# Altium schematic sheet DSPCONN.12-15.SCHDOC: Backplane
size B; Engineer: Eric Jonas; Organization: Wilson Lab; Address1: Picower Institute, MIT; Address2: 43 Vassar St. 46-5227; Address3: Cambridge, MA 02139; Address4: Australia 2086
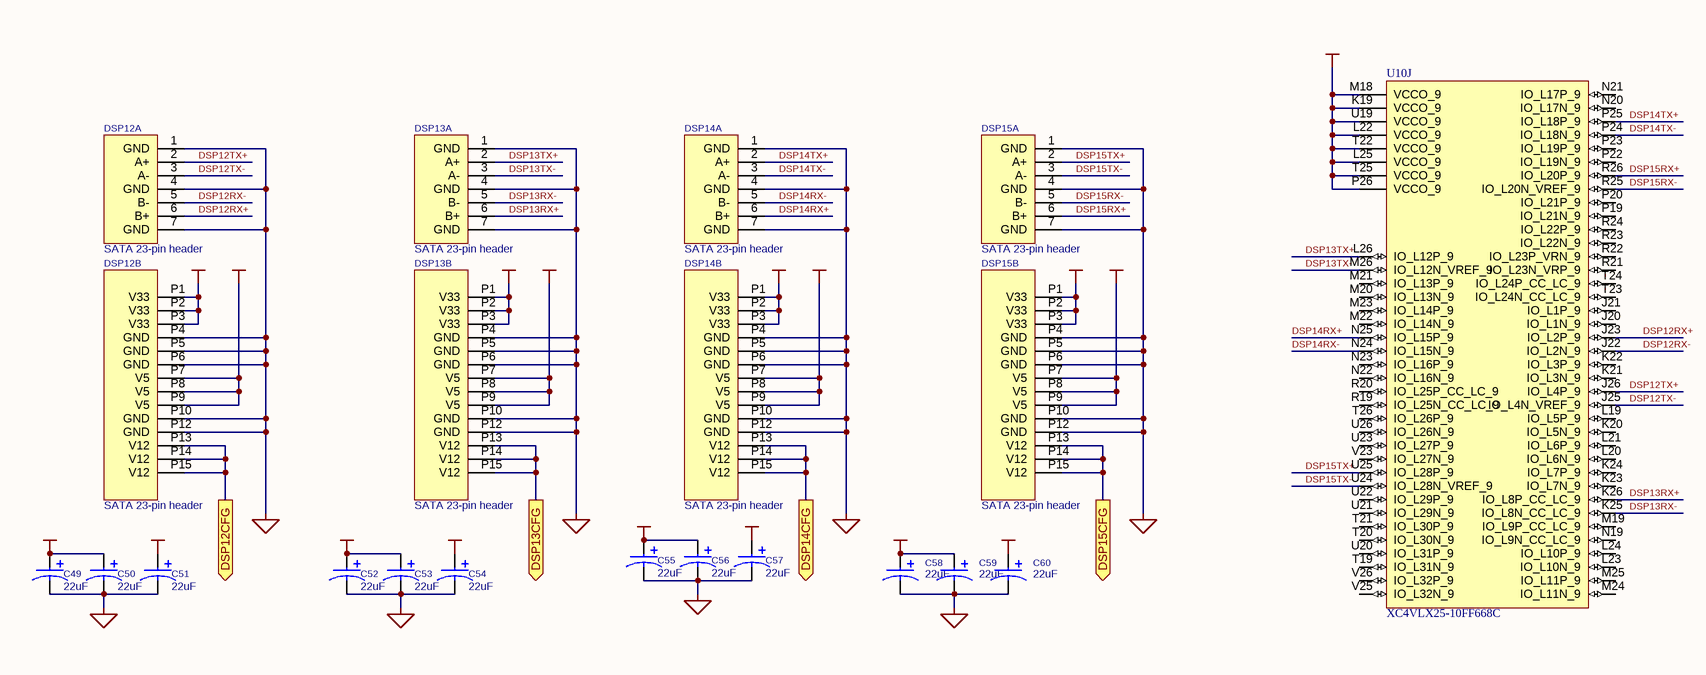
[diagram p0: DSPCONN.12-15.SCHDOC]

## Parts
C49  value 22uF  [6032]  (hidden comment: POLCAP2)
C50  value 22uF  [6032]  (hidden comment: POLCAP2)
C51  value 22uF  [6032]  (hidden comment: POLCAP2)
C52  value 22uF  [6032]  (hidden comment: POLCAP2)
C53  value 22uF  [6032]  (hidden comment: POLCAP2)
C54  value 22uF  [6032]  (hidden comment: POLCAP2)
C55  value 22uF  [6032]  (hidden comment: POLCAP2)
C56  value 22uF  [6032]  (hidden comment: POLCAP2)
C57  value 22uF  [6032]  (hidden comment: POLCAP2)
C58  value 22uF  [6032]  (hidden comment: POLCAP2)
C59  value 22uF  [6032]  (hidden comment: POLCAP2)
C60  value 22uF  [6032]  (hidden comment: POLCAP2)
DSP12  SATA 23-pin header  [MOLEX 87713-1001]  (parts A,B of 2)
DSP13  SATA 23-pin header  [MOLEX 87713-1001]  (parts A,B of 2)
DSP14  SATA 23-pin header  [MOLEX 87713-1001]  (parts A,B of 2)
DSP15  SATA 23-pin header  [MOLEX 87713-1001]  (parts A,B of 2)
U10  XC4VLX25-10FF668C  [Xilinx FF668]  (part J of 13)

## Ports
DSP12CFG (out), DSP13CFG (out), DSP14CFG (out), DSP15CFG (out)

## Nets
+2.5VCC: U10.K19(VCCO_9) U10.L22(VCCO_9) U10.L25(VCCO_9) U10.M18(VCCO_9) U10.P26(VCCO_9) U10.T22(VCCO_9) U10.T25(VCCO_9) U10.U19(VCCO_9)
+5VCC: C51.1 C54.1 C57.1 C60.1 DSP12.P7(V5) DSP12.P8(V5) DSP12.P9(V5) DSP13.P7(V5) DSP13.P8(V5) DSP13.P9(V5) DSP14.P7(V5) DSP14.P8(V5) DSP14.P9(V5) DSP15.P7(V5) DSP15.P8(V5) DSP15.P9(V5)
GND: C49.2 C50.2 C51.2 C52.2 C53.2 C54.2 C55.2 C56.2 C57.2 C58.2 C59.2 C60.2 DSP12.1(GND) DSP12.4(GND) DSP12.7(GND) DSP12.P4(GND) DSP12.P5(GND) DSP12.P6(GND) DSP12.P10(GND) DSP12.P12(GND) DSP13.1(GND) DSP13.4(GND) DSP13.7(GND) DSP13.P4(GND) DSP13.P5(GND) DSP13.P6(GND) DSP13.P10(GND) DSP13.P12(GND) DSP14.1(GND) DSP14.4(GND) DSP14.7(GND) DSP14.P4(GND) DSP14.P5(GND) DSP14.P6(GND) DSP14.P10(GND) DSP14.P12(GND) DSP15.1(GND) DSP15.4(GND) DSP15.7(GND) DSP15.P4(GND) DSP15.P5(GND) DSP15.P6(GND) DSP15.P10(GND) DSP15.P12(GND)
VCC2: C49.1 C50.1 C52.1 C53.1 C55.1 C56.1 C58.1 C59.1 DSP12.P1(V33) DSP12.P2(V33) DSP12.P3(V33) DSP13.P1(V33) DSP13.P2(V33) DSP13.P3(V33) DSP14.P1(V33) DSP14.P2(V33) DSP14.P3(V33) DSP15.P1(V33) DSP15.P2(V33) DSP15.P3(V33)
DSP12CFG: DSP12.P13(V12) DSP12.P14(V12) DSP12.P15(V12) ; port DSP12CFG
DSP12RX+: DSP12.6(B+) U10.J23(IO_L2P_9)
DSP12RX-: DSP12.5(B-) U10.J22(IO_L2N_9)
DSP12TX+: DSP12.2(A+) U10.J26(IO_L4P_9)
DSP12TX-: DSP12.3(A-) U10.J25(IO_L4N_VREF_9)
DSP13CFG: DSP13.P13(V12) DSP13.P14(V12) DSP13.P15(V12) ; port DSP13CFG
DSP13RX+: DSP13.6(B+) U10.K26(IO_L8P_CC_LC_9)
DSP13RX-: DSP13.5(B-) U10.K25(IO_L8N_CC_LC_9)
DSP13TX+: DSP13.2(A+) U10.L26(IO_L12P_9)
DSP13TX-: DSP13.3(A-) U10.M26(IO_L12N_VREF_9)
DSP14CFG: DSP14.P13(V12) DSP14.P14(V12) DSP14.P15(V12) ; port DSP14CFG
DSP14RX+: DSP14.6(B+) U10.N25(IO_L15P_9)
DSP14RX-: DSP14.5(B-) U10.N24(IO_L15N_9)
DSP14TX+: DSP14.2(A+) U10.P25(IO_L18P_9)
DSP14TX-: DSP14.3(A-) U10.P24(IO_L18N_9)
DSP15CFG: DSP15.P13(V12) DSP15.P14(V12) DSP15.P15(V12) ; port DSP15CFG
DSP15RX+: DSP15.6(B+) U10.R26(IO_L20P_9)
DSP15RX-: DSP15.5(B-) U10.R25(IO_L20N_VREF_9)
DSP15TX+: DSP15.2(A+) U10.U25(IO_L28P_9)
DSP15TX-: DSP15.3(A-) U10.U24(IO_L28N_VREF_9)

Not connected (* = marked no-connect by the designer): U10 J20(IO_L1N_9) J21(IO_L1P_9) K20(IO_L5N_9) K21(IO_L3N_9) K22(IO_L3P_9) K23(IO_L7N_9) K24(IO_L7P_9) L19(IO_L5P_9) L20(IO_L6N_9) L21(IO_L6P_9) L23(IO_L10N_9) L24(IO_L10P_9) M19(IO_L9P_CC_LC_9) M20(IO_L13N_9) M21(IO_L13P_9) M22(IO_L14N_9) M23(IO_L14P_9) M24(IO_L11N_9) M25(IO_L11P_9) N19(IO_L9N_CC_LC_9) N20(IO_L17N_9) N21(IO_L17P_9) N22(IO_L16N_9) N23(IO_L16P_9) P19(IO_L21N_9) P20(IO_L21P_9) P22(IO_L19N_9) P23(IO_L19P_9) R19(IO_L25N_CC_LC_9) R20(IO_L25P_CC_LC_9) R21(IO_L23N_VRP_9) R22(IO_L23P_VRN_9) R23(IO_L22N_9) R24(IO_L22P_9) T19(IO_L31N_9) T20(IO_L30N_9) T21(IO_L30P_9) T23(IO_L24N_CC_LC_9) T24(IO_L24P_CC_LC_9) T26(IO_L26P_9) U20(IO_L31P_9) U21(IO_L29N_9) U22(IO_L29P_9) U23(IO_L27P_9) U26(IO_L26N_9) V23(IO_L27N_9) V25(IO_L32N_9) V26(IO_L32P_9)

## Notes on the sheet
- Title:
- Engineer:
- Date:
- Revision:
- Sheet
- of
- File:

## Library data of the parts
C49-C60 = POLCAP2: Standard Capacitor
DSP12-DSP15 = SATA-23
U10 = XC4VLX25-10FF668C: Xilinx Virtex-4